# Altium schematic sheet E1706RS485.SchDoc
size B
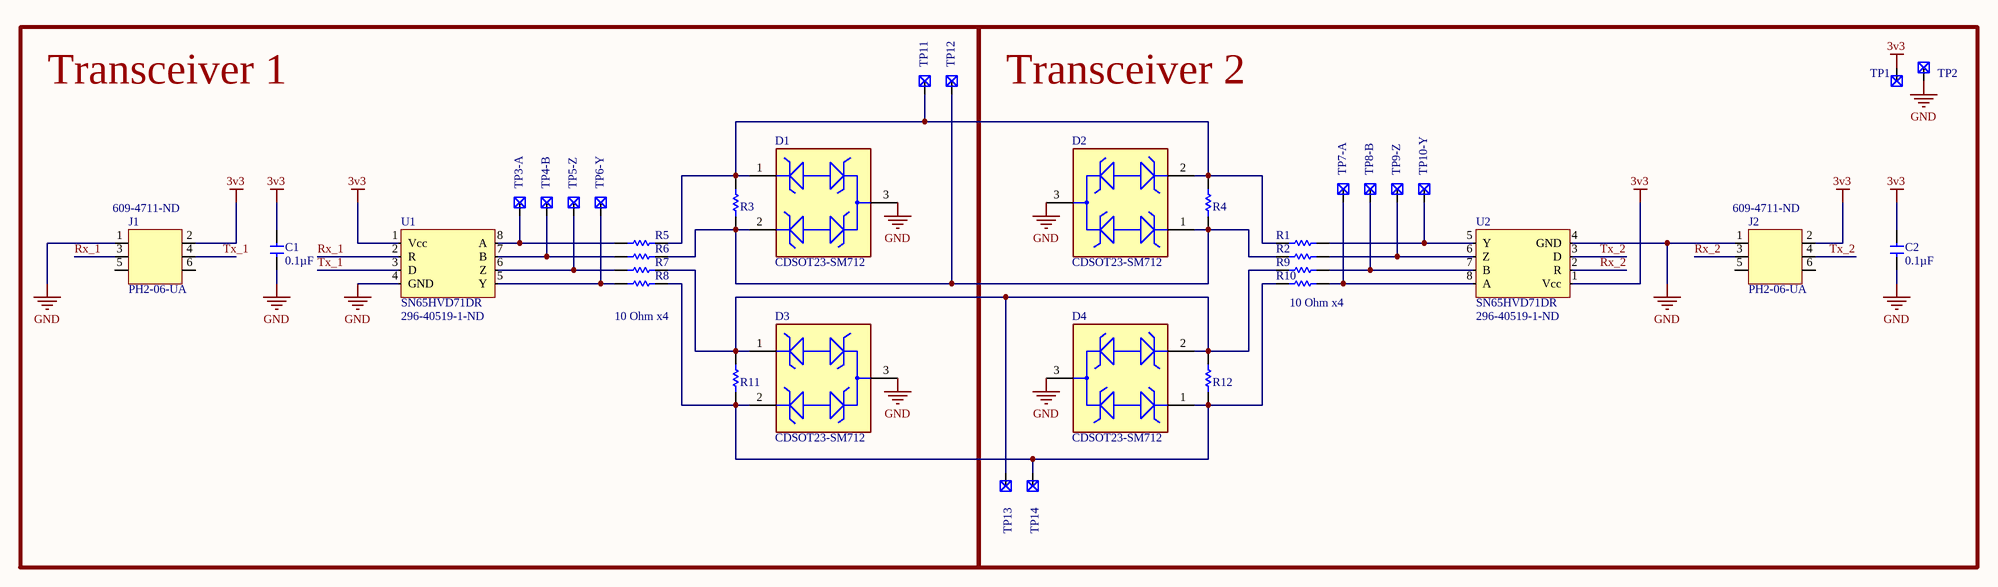
[diagram p0: E1706RS485.SchDoc]

## Parts
C1  Capacitance: 0.1µF  [CAPC1608N]  (hidden comment: 0.1uF)
C2  Capacitance: 0.1µF  [CAPC1608N]  (hidden comment: 0.1uF)
D1  CDSOT23-SM712  [FP-SOT23-MFG]
D2  CDSOT23-SM712  [FP-SOT23-MFG]
D3  CDSOT23-SM712  [FP-SOT23-MFG]
D4  CDSOT23-SM712  [FP-SOT23-MFG]
J1  PH2-06-UA  Supplier Part Number 1: 609-4711-ND  [PH2-06-UA]
J2  PH2-06-UA  Supplier Part Number 1: 609-4711-ND  [PH2-06-UA]
R1  Res_10_0805  [RESC2012N]  (value not drawn)
R2  Res_10_0805  [RESC2012N]  (value not drawn)
R3  Res_120_0805  [RESC2012N]  (value not drawn)
R4  Res_120_0805  [RESC2012N]  (value not drawn)
R5  Res_10_0805  [RESC2012N]  (value not drawn)
R6  Res_10_0805  [RESC2012N]  (value not drawn)
R7  Res_10_0805  [RESC2012N]  (value not drawn)
R8  Res_10_0805  [RESC2012N]  (value not drawn)
R9  Res_10_0805  [RESC2012N]  (value not drawn)
R10  Res_10_0805  [RESC2012N]  (value not drawn)
R11  Res_120_0805  [RESC2012N]  (value not drawn)
R12  Res_120_0805  [RESC2012N]  (value not drawn)
TP1  Testpoint  [TEST_POINT_TH]  (value not drawn)  (no BOM)
TP2  Testpoint  [TEST_POINT_TH]  (value not drawn)  (no BOM)
TP3-A  Testpoint  [TEST_POINT_TH]  (value not drawn)  (no BOM)
TP4-B  Testpoint  [TEST_POINT_TH]  (value not drawn)  (no BOM)
TP5-Z  Testpoint  [TEST_POINT_TH]  (value not drawn)  (no BOM)
TP6-Y  Testpoint  [TEST_POINT_TH]  (value not drawn)  (no BOM)
TP7-A  Testpoint  [TEST_POINT_TH]  (value not drawn)  (no BOM)
TP8-B  Testpoint  [TEST_POINT_TH]  (value not drawn)  (no BOM)
TP9-Z  Testpoint  [TEST_POINT_TH]  (value not drawn)  (no BOM)
TP10-Y  Testpoint  [TEST_POINT_TH]  (value not drawn)  (no BOM)
TP11  Testpoint  [TEST_POINT_TH]  (value not drawn)  (no BOM)
TP12  Testpoint  [TEST_POINT_TH]  (value not drawn)  (no BOM)
TP13  Testpoint  [TEST_POINT_TH]  (value not drawn)  (no BOM)
TP14  Testpoint  [TEST_POINT_TH]  (value not drawn)  (no BOM)
U1  SN65HVD71DR  Supplier Part Number 1: 296-40519-1-ND  [SN65HVD71DR]
U2  SN65HVD71DR  Supplier Part Number 1: 296-40519-1-ND  [SN65HVD71DR]

## Blocks framed on the sheet
Transceiver 1: C1 D1 D3 J1 R3 R5-R8 R11 TP3-A TP4-B TP5-Z TP6-Y TP11 TP12 U1
Transceiver 2: C2 D2 D4 J2 R1 R2 R4 R9 R10 R12 TP1 TP2 TP7-A TP8-B TP9-Z TP10-Y TP13 TP14 U2

## Nets
3v3: C1.2 C2.2 J1.2 J2.2 TP1.1(Test) U1.1(Vcc) U2.1(Vcc)
GND: C1.1 C2.1 D1.3 D2.3 D3.3 D4.3 J1.1 J2.1 TP2.1(Test) U1.4(GND) U2.4(GND)
Rx_1: J1.3 U1.2(R)
Rx_2: J2.3 U2.2(R)
Tx_1: J1.4 U1.3(D)
Tx_2: J2.4 U2.3(D)
NetD1_1: D1.1 D2.2 R1.1 R3.2 R4.2 R5.2 TP11.1(Test)
NetD1_2: D1.2 D2.1 R2.1 R3.1 R4.1 R6.2 TP12.1(Test)
NetD3_1: D3.1 D4.2 R7.2 R9.1 R11.2 R12.2 TP13.1(Test)
NetD3_2: D3.2 D4.1 R8.2 R10.1 R11.1 R12.1 TP14.1(Test)
NetR1_2: R1.2 TP10-Y.1(Test) U2.5(Y)
NetR2_2: R2.2 TP9-Z.1(Test) U2.6(Z)
NetR5_1: R5.1 TP3-A.1(Test) U1.8(A)
NetR6_1: R6.1 TP4-B.1(Test) U1.7(B)
NetR7_1: R7.1 TP5-Z.1(Test) U1.6(Z)
NetR8_1: R8.1 TP6-Y.1(Test) U1.5(Y)
NetR9_2: R9.2 TP8-B.1(Test) U2.7(B)
NetR10_2: R10.2 TP7-A.1(Test) U2.8(A)

Not connected (* = marked no-connect by the designer): J1 5 6; J2 5 6

## Notes on the sheet
- 10 Ohm x4
- (near R10) 10 Ohm x4

## Library data of the parts
C1 C2 = Cap_0.1uF_25V_0603: CAP CER 0.1UF 25V 10% X7R 0603; Manufacturer P/N: GRM188R71E104KA01D; Manufacturer: Murata Electronics North America; Supplier 1: Digi-Key; Supplier Part Number 1: 490-1524-1-ND; RoHS: RoHS Compliant; Voltage - Rated: 25V; Tolerance: ±10%; Temperature Coefficient: X7R; Operating Temperature: -55°C ~ 125°C; Package / Case: 0603 (1608 Metric); ComponentLink1URL: http://psearch.murata.com/capacitor/product/GRM188R71E104KA01#.pdf; ComponentLink1Description: Datasheet; Supplier 2: Digi-Key; Supplier Part Number 2: 490-1524-2-ND
D1-D4 = CMP-2000-05081-2: TVS DIODE 7V/12V 14V/26V SOT23-3; Manufacturer: Bourns Inc.; Peak Pulse Current: 17A; Standoff Height: 0.05mm; Breakdown Voltage: 7.5V; Direction: Bidirectional; Clamping Voltage: 26V; Value: 75pF; Number Of Channels: 2; Reverse Standoff Voltage: 12V; Peak Pulse Power: 400W; Max Surge Current: 30A; Polarity: Bidirectional,Unidirectional; Min Breakdown Voltage: 13.3V; Power Line Protection: No; Leakage Current: 20uA; Element Configuration: Dual; Diode Type: ZENER; Max Power Dissipation: 600W; Test Current: 1mA; ESD Protection: Yes; Temperature Range Low: -55°C; Mouser Description: Transient Voltage Suppressor, TVS, CDSOT23 Series, Unidirectional, 12 V, SOT-23, 3, 13.3 V; Device Class L3: unset; Package: SOT23; Height: 1.17mm; RoHS: TRUE; Octopart: https://octopart.com/cdsot23-sm712-bourns-7576327; Category: Diode; Ipc Land Pattern Name: SOT95P229X103-3; ComponentLink2URL: https://www.bourns.com/docs/Product-Datasheets/CDSOT23-SM712.pdf; Temperature Range High: +150°C; ComponentLink2Description: Datasheet; Digikey Description: TVS DIODE 7V/12V 14V/26V SOT23-3; Manufacturer Part Number: CDSOT23-SM712; Temperature: -55°C to +150°C; Device Class L2: TVS Diodes; Lead Free: Yes; Device Class L1: Circuit Protection; Automotive: No; Capacitance: 75pF; Supplier 1: Digi-Key; Supplier Part Number 1: CDSOT23-SM712CT-ND; Stock 1: 37537; Pricing 1: 1=1.63000, 10=1.46000, 100=1.13850, 500=0.94050, 1000=0.74250 (USD); Mount: Surface Mount; Case/Package: SOT-23; Number of Pins: 3; Contact Plating: Tin; Min Operating Temperature: -55°C; Max Operating Temperature: 150°C; Packaging: Tape and Reel; Package Quantity: 1; Series: -; Working Voltage: 12V; Termination: SMD/SMT; Resistor Type: Zener; Number of Elements: 2; Reverse Breakdown Voltage: 13.3V; Number of Bidirectional Channels: 2; Power Dissipation: 400W; Max Reverse Leakage Current: 20uA; Max Breakdown Voltage: 13.3V; Length: 3.04mm; Width: 0.055inch; Depth: 1.4mm; Radiation Hardening: No; REACH SVHC: No SVHC; RoHS Compliant: Yes; ComponentLink1URL: https://datasheet.ciiva.com/1281/1670933-1281331.pdf?src-supplier=Farnell; ComponentLink1Description: https://datasheet.ciiva.com/1281/1670933-1281331.pdf?src-supplier=Farnell; ComponentLink3URL: https://datasheet.ciiva.com/4510/cdsot23-sm712-25932-4510261.pdf?src-supplier=Mouser; ComponentLink3Description: https://datasheet.ciiva.com/4510/cdsot23-sm712-25932-4510261.pdf?src-supplier=Mouser; ComponentLink4URL: https://datasheet.ciiva.com/11193/cdsot23-sm712-11193846.pdf?src-supplier=Avnet; ComponentLink4Description: https://datasheet.ciiva.com/11193/cdsot23-sm712-11193846.pdf?src-supplier=Avnet; ComponentLink5URL: https://datasheet.ciiva.com/16582/cdsot23-sm712-16582189.pdf?src-supplier=Avnet+Europe; ComponentLink5Description: https://datasheet.ciiva.com/16582/cdsot23-sm712-16582189.pdf?src-supplier=Avnet+Europe; ComponentLink6URL: https://datasheet.ciiva.com/337/cdsot23-sm712-337451.pdf?src-supplier=Digi-Key; ComponentLink6Description: https://datasheet.ciiva.com/337/cdsot23-sm712-337451.pdf?src-supplier=Digi-Key; ComponentLink7URL: https://datasheet.ciiva.com/337/cdsot23-sm712-337452.pdf?src-supplier=Digi-Key; ComponentLink7Description: https://datasheet.ciiva.com/337/cdsot23-sm712-337452.pdf?src-supplier=Digi-Key; ComponentLink8URL: https://datasheet.ciiva.com/26828/getdatasheetpartid-418501-26828522.pdf?src-supplier=Verical; ComponentLink8Description: https://datasheet.ciiva.com/26828/getdatasheetpartid-418501-26828522.pdf?src-supplier=Verical; ComponentLink9URL: https://datasheet.ciiva.com/22696/1670933-22696779.pdf?src-supplier=Element14; ComponentLink9Description: https://datasheet.ciiva.com/22696/1670933-22696779.pdf?src-supplier=Element14
J1 J2 = PH2-06-UA: Conn;  Rect;  Header;  6 Pos;  2.54mm Pitch;  Bergstik II;  Self Ret;  High Temp; Manufacturer: Amphenol ICC / FCI; Manufacturer Part Number: 69192-406HLF; Current Rating: 3A; Voltage Rating: 1.5kV; Number of Positions: 6; Insulation Resistance: 5GR; Gender: Male; Connector Type: Male Pin; Row Spacing: 0.1inch; Contact Post Length: 3.05mm; Supplier 1: Digi-Key; RoHS: Yes; Category: Headers and Wire Housings; Stock 1: 2225; Pricing 1: 1=0.40000, 10=0.37600, 100=0.26330, 500=0.22568, 1000=0.18806, 5000=0.16120, 10000=0.15045 (USD); Mount: Through Hole; Color: Black; Contact Plating: Tin; Contact Material: Bronze,Tin; Housing Color: Black; Housing Material: Thermoplastic; Package Quantity: 100; Packaging: Bulk; Number of Rows: 2; Contact Gender: Male; Termination: Solder; Number of Contacts: 6; Orientation: Straight; Series: BERGSTIK® II, MezzSelect™, Basics+; Contact Type: Male Pin; Length: 7.62mm; Pitch: 2.54mm; Contact Mating Length: 0.23inch; Depth: 4.83mm; Radiation Hardening: No; REACH SVHC: No SVHC; RoHS Compliant: Yes; ComponentLink1URL: https://datasheet.ciiva.com/22873/70302519-22873100.pdf?src-supplier=Allied+Electronics; ComponentLink1Description: https://datasheet.ciiva.com/22873/70302519-22873100.pdf?src-supplier=Allied+Electronics; ComponentLink2URL: https://datasheet.ciiva.com/10147/69192-10147733.pdf?src-supplier=Avnet; ComponentLink2Description: https://datasheet.ciiva.com/10147/69192-10147733.pdf?src-supplier=Avnet
R1 R2 R5-R10 = Res_10_0805: RES 10 OHM 1/8W 1% 0805; Manufacturer: Vishay Dale; Manufacturer P/N: CRCW080510R0FKEA; Power (Watts): 0.125W, 1/8W; Temperature Coefficient: ±100ppm/°C; Resistance (Ohms): 10; Supplier 1: Digi-Key; Supplier Part Number 1: 541-10.0CCT-ND; RoHS: RoHS Compliant; Composition: Thick Film; Features: Automotive AEC-Q200 Qualified; Tolerance: ±1%; Package / Case: 0805 (2012 Metric); ComponentLink1URL: http://www.vishay.com/doc?20035; ComponentLink1Description: Datasheet; Supplier 2: Digi-Key; Supplier Part Number 2: 541-10.0CTR-ND
R3 R4 R11 R12 = Res_120_0805: RES 120 OHM 1/8W 1% 0805
TP1 TP2 TP3-A TP4-B TP5-Z TP6-Y TP7-A TP8-B TP9-Z TP10-Y TP11-TP14 = Test Point_1: Value: Test Point
U1 U2 = SN65HVD71DR: Single Transmitter/Receiver RS-485 8-Pin SOIC T/R; Manufacturer: Texas Instruments; Data Rate: 400Kbps; Number of Transmitters: 1; Operating Supply Voltage: 3.3V; Simplex/Duplex: Full Duplex; Receiver Hysteresis: 70mV; Supplier 1: Digi-Key; Manufacturer Part Number: SN65HVD71DR; RoHS: Yes; Category: RS-232 / RS-422 / RS-485 Interface ICs; Stock 1: 1611; Pricing 1: 1=3.41000, 10=3.06300, 25=2.89520, 100=2.50930, 250=2.38064, 500=2.13616, 1000=2.12450 (USD); Mount: Surface Mount; Case/Package: SOIC; Number of Pins: 8; Min Operating Temperature: -40°C; Max Operating Temperature: 125°C; Packaging: Tape and Reel; Logic Function: Receiver; Lead Free: Lead Free; RoHS Compliant: Yes; ComponentLink1URL: https://datasheet.ciiva.com/48475/sn65hvd70-48475464.pdf?src-supplier=Avnet; ComponentLink1Description: https://datasheet.ciiva.com/48475/sn65hvd70-48475464.pdf?src-supplier=Avnet